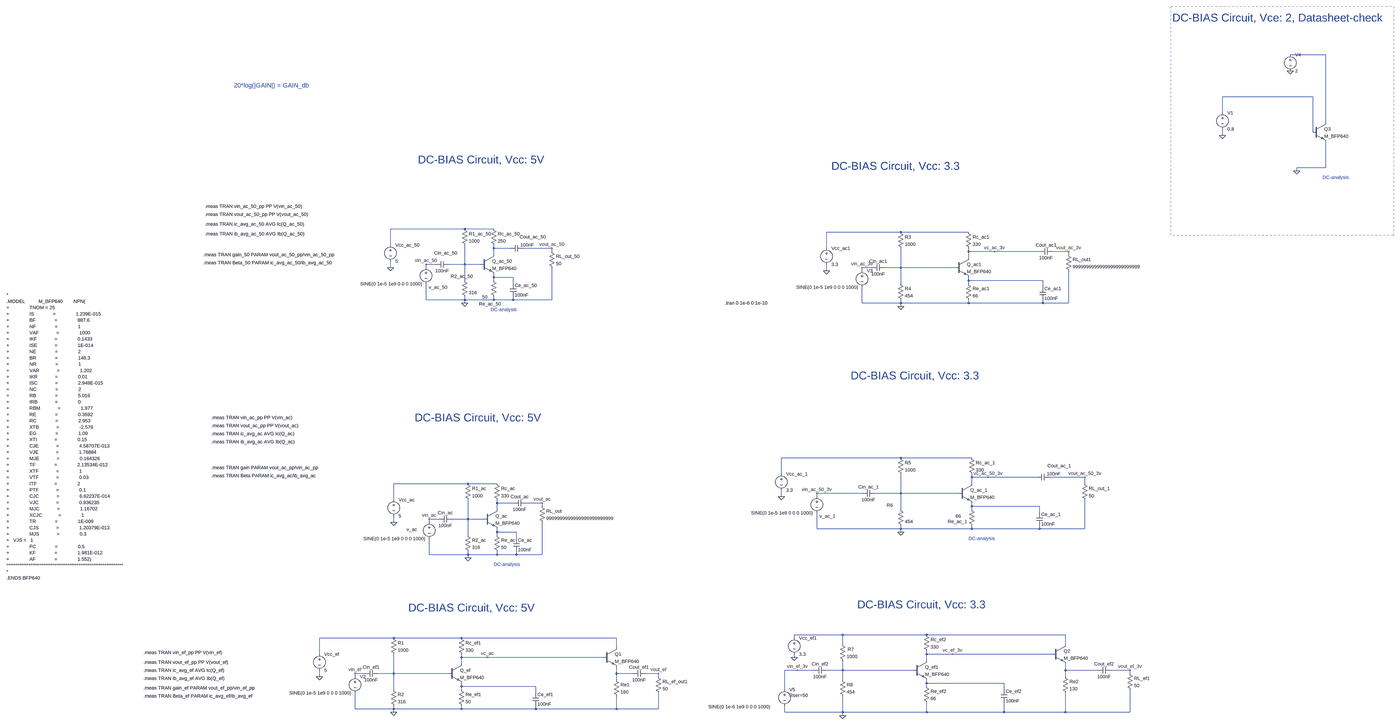
[diagram p0: schematic BP640_AC.asc, whole sheet]
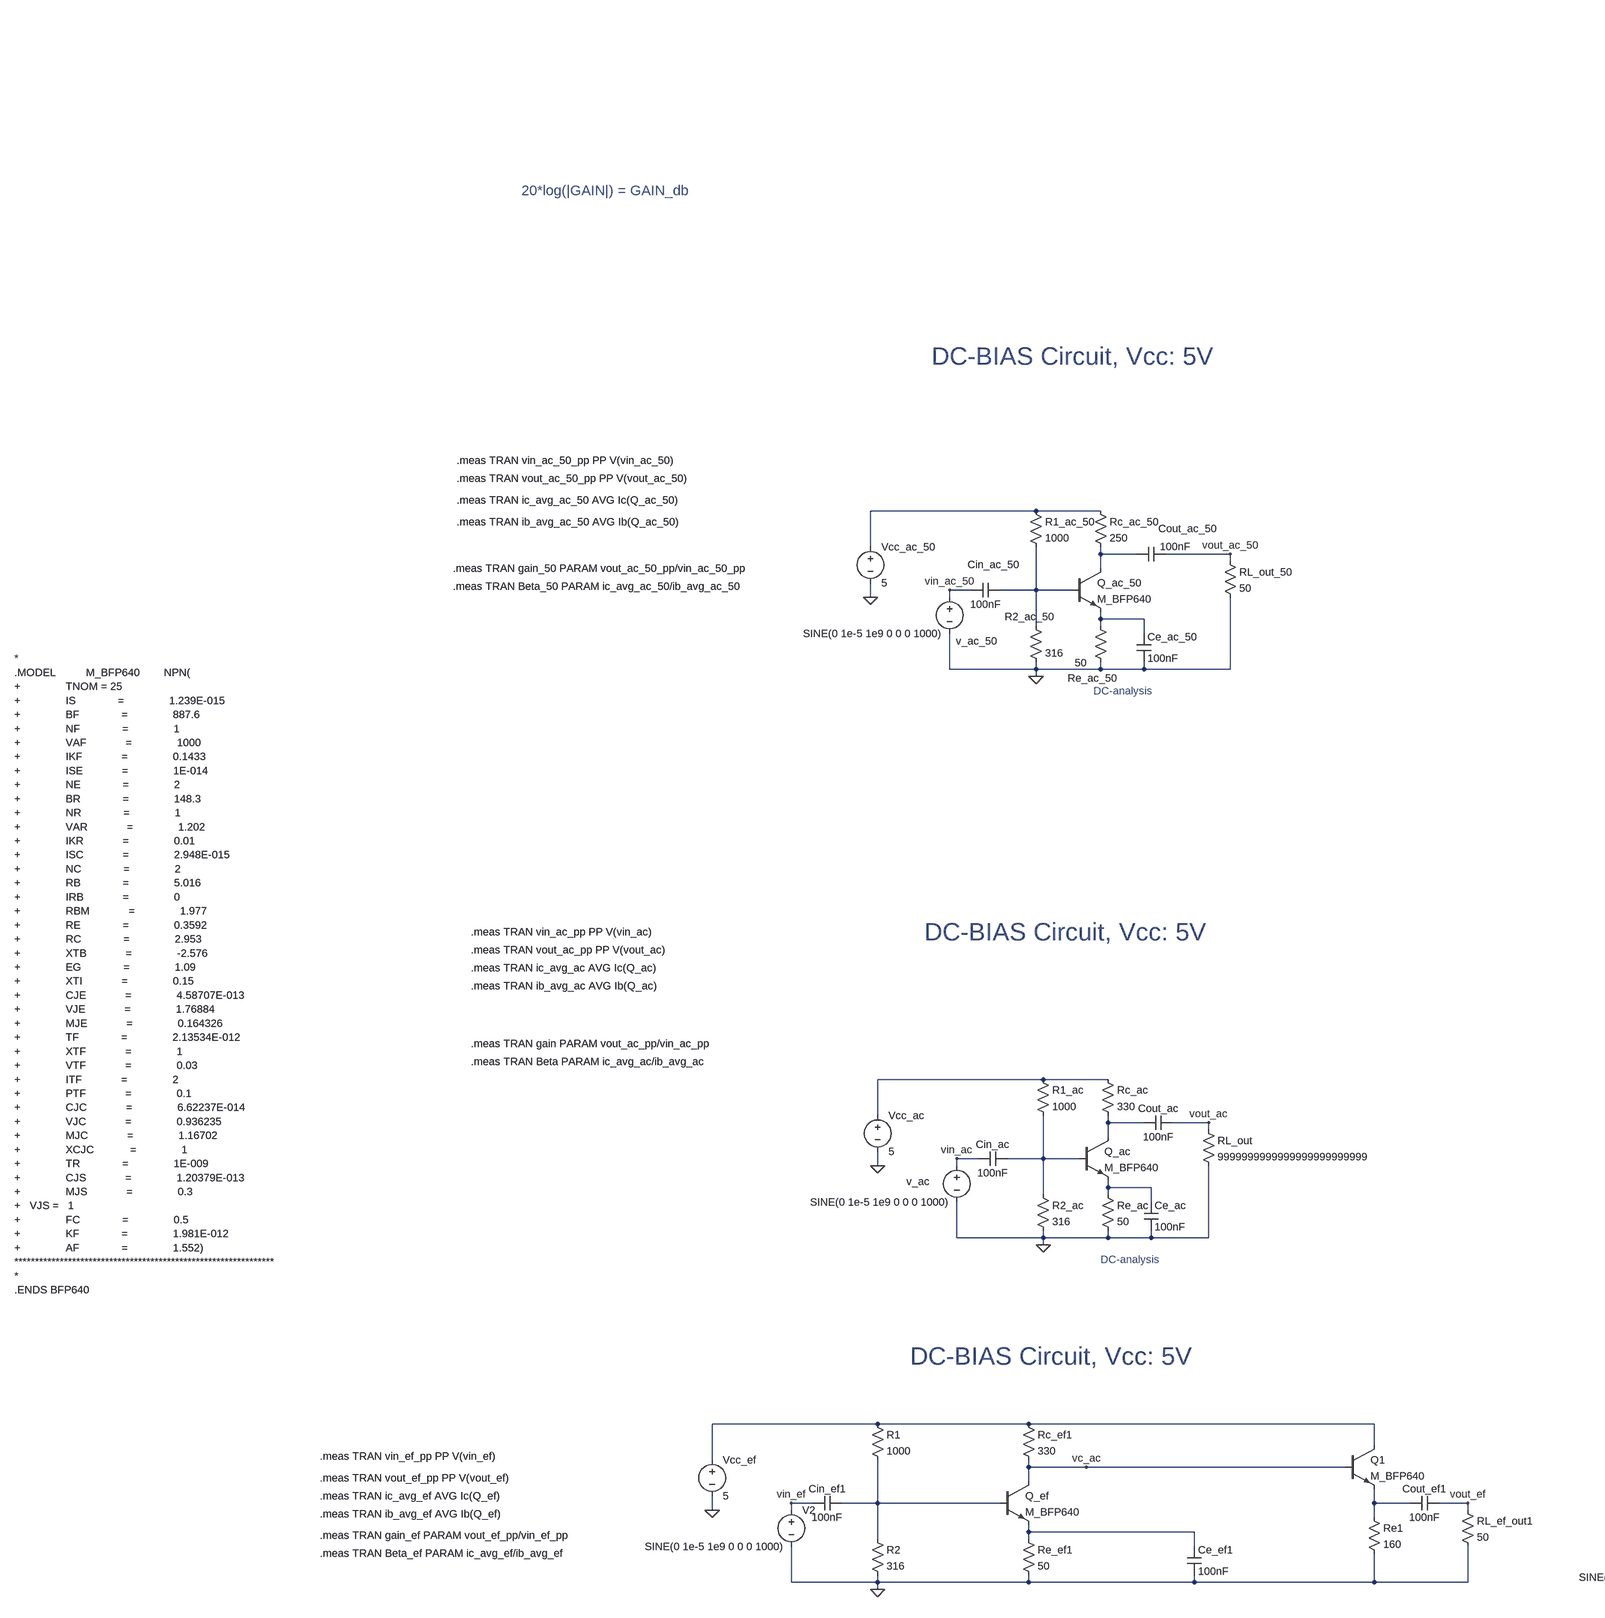
[diagram p1: schematic BP640_AC.asc, part, row 1 of 1, column 1 of 2]
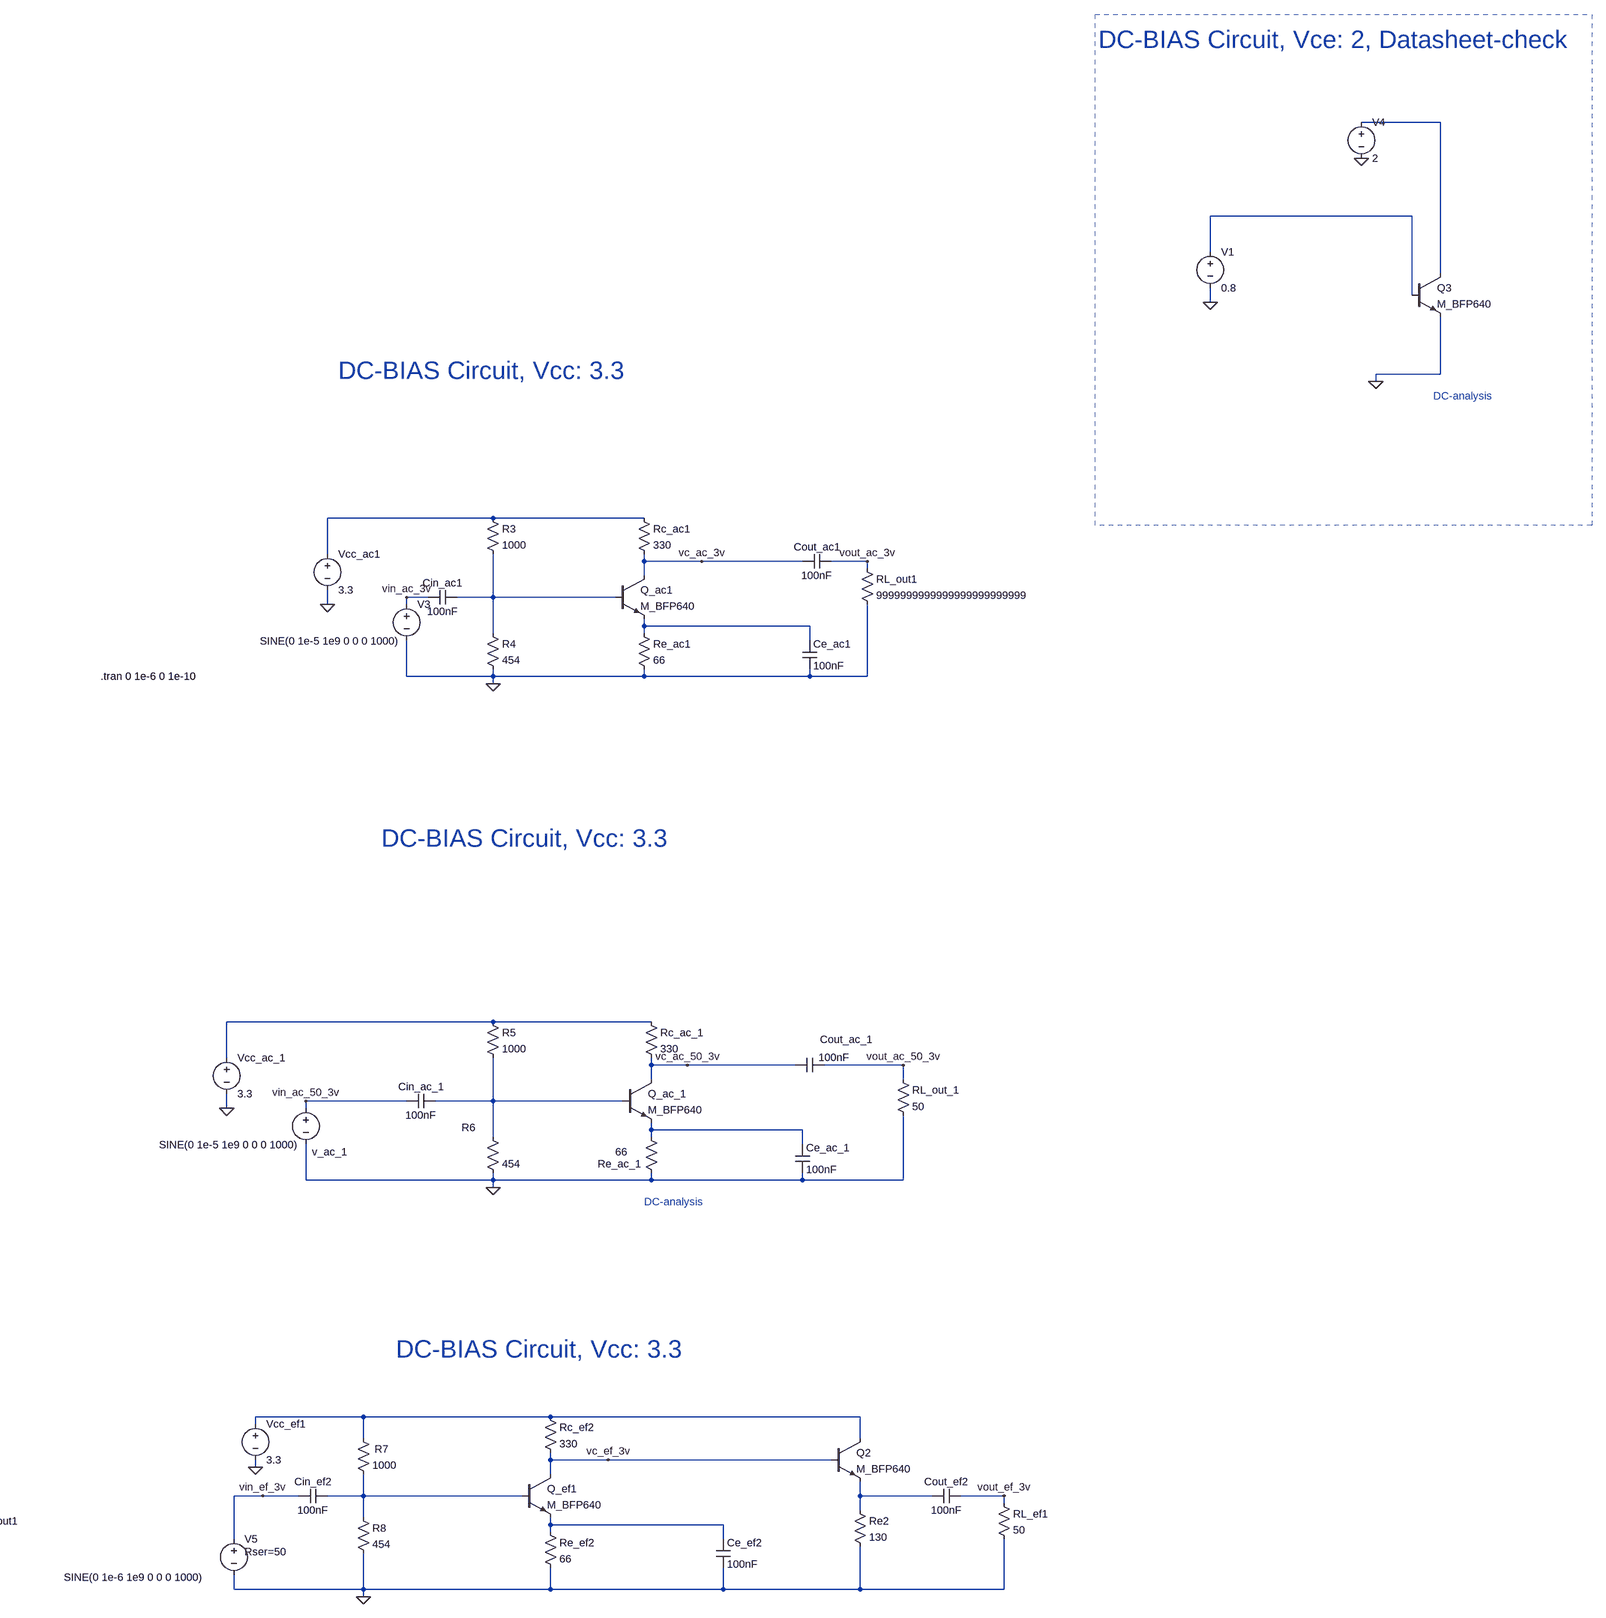
[diagram p2: schematic BP640_AC.asc, part, row 1 of 1, column 2 of 2]
BP640_AC.asc, the LTspice schematic file:
Version 4
SHEET 1 9212 2740
WIRE 8864 -992 8688 -992
WIRE 8800 -784 8352 -784
WIRE 8352 -704 8352 -784
WIRE 8864 -656 8864 -992
WIRE 8800 -608 8800 -784
WIRE 8352 -592 8352 -624
WIRE 8864 -432 8864 -560
WIRE 8864 -432 8720 -432
WIRE 8720 -416 8720 -432
WIRE 2560 -128 2192 -128
WIRE 2704 -128 2560 -128
WIRE 4816 -112 4448 -112
WIRE 5152 -112 4816 -112
WIRE 2192 -48 2192 -128
WIRE 2704 -32 2704 -48
WIRE 2784 -32 2704 -32
WIRE 2992 -32 2848 -32
WIRE 4448 -32 4448 -112
WIRE 2992 -16 2992 -32
WIRE 5152 -16 5152 -32
WIRE 5280 -16 5152 -16
WIRE 5504 -16 5280 -16
WIRE 5648 -16 5568 -16
WIRE 2704 0 2704 -32
WIRE 5648 0 5648 -16
WIRE 5152 16 5152 -16
WIRE 2416 48 2368 48
WIRE 2560 48 2560 -48
WIRE 2560 48 2480 48
WIRE 2640 48 2560 48
WIRE 2192 64 2192 32
WIRE 2368 64 2368 48
WIRE 4672 64 4624 64
WIRE 4816 64 4816 -32
WIRE 4816 64 4736 64
WIRE 5088 64 4816 64
WIRE 4448 80 4448 48
WIRE 4624 80 4624 64
WIRE 2704 112 2704 96
WIRE 2800 112 2704 112
WIRE 2560 128 2560 48
WIRE 2704 128 2704 112
WIRE 5152 128 5152 112
WIRE 5520 128 5152 128
WIRE 2800 144 2800 112
WIRE 4816 144 4816 64
WIRE 5152 144 5152 128
WIRE 5520 160 5520 128
WIRE 2368 224 2368 144
WIRE 2560 224 2560 208
WIRE 2560 224 2368 224
WIRE 2704 224 2704 208
WIRE 2704 224 2560 224
WIRE 2800 224 2800 208
WIRE 2800 224 2704 224
WIRE 2992 224 2992 64
WIRE 2992 224 2800 224
WIRE 2560 240 2560 224
WIRE 4624 240 4624 160
WIRE 4816 240 4816 224
WIRE 4816 240 4624 240
WIRE 5152 240 5152 224
WIRE 5152 240 4816 240
WIRE 5520 240 5520 224
WIRE 5520 240 5152 240
WIRE 5648 240 5648 80
WIRE 5648 240 5520 240
WIRE 4816 256 4816 240
WIRE 4816 1008 4224 1008
WIRE 5168 1008 4816 1008
WIRE 4224 1088 4224 1008
WIRE 5168 1104 5168 1088
WIRE 5248 1104 5168 1104
WIRE 5488 1104 5248 1104
WIRE 5728 1104 5552 1104
WIRE 2576 1136 2208 1136
WIRE 2720 1136 2576 1136
WIRE 5168 1136 5168 1104
WIRE 5728 1136 5728 1104
WIRE 4624 1184 4400 1184
WIRE 4816 1184 4816 1088
WIRE 4816 1184 4688 1184
WIRE 5104 1184 4816 1184
WIRE 4224 1200 4224 1168
WIRE 4400 1200 4400 1184
WIRE 2208 1216 2208 1136
WIRE 2720 1232 2720 1216
WIRE 2800 1232 2720 1232
WIRE 2944 1232 2864 1232
WIRE 2944 1248 2944 1232
WIRE 5168 1248 5168 1232
WIRE 5504 1248 5168 1248
WIRE 2720 1264 2720 1232
WIRE 4816 1264 4816 1184
WIRE 5168 1264 5168 1248
WIRE 5504 1280 5504 1248
WIRE 2432 1312 2384 1312
WIRE 2576 1312 2576 1216
WIRE 2576 1312 2496 1312
WIRE 2656 1312 2576 1312
WIRE 2208 1328 2208 1296
WIRE 2384 1328 2384 1312
WIRE 4400 1360 4400 1280
WIRE 4816 1360 4816 1344
WIRE 4816 1360 4400 1360
WIRE 5168 1360 5168 1344
WIRE 5168 1360 4816 1360
WIRE 5504 1360 5504 1344
WIRE 5504 1360 5168 1360
WIRE 5728 1360 5728 1216
WIRE 5728 1360 5504 1360
WIRE 2720 1376 2720 1360
WIRE 2816 1376 2720 1376
WIRE 4816 1376 4816 1360
WIRE 2576 1392 2576 1312
WIRE 2720 1392 2720 1376
WIRE 2816 1408 2816 1376
WIRE 2384 1488 2384 1408
WIRE 2576 1488 2576 1472
WIRE 2576 1488 2384 1488
WIRE 2720 1488 2720 1472
WIRE 2720 1488 2576 1488
WIRE 2816 1488 2816 1472
WIRE 2816 1488 2720 1488
WIRE 2944 1488 2944 1328
WIRE 2944 1488 2816 1488
WIRE 2576 1504 2576 1488
WIRE 4528 2176 4288 2176
WIRE 4944 2176 4528 2176
WIRE 5632 2176 4944 2176
WIRE 2208 2192 1840 2192
WIRE 2544 2192 2208 2192
WIRE 3312 2192 2544 2192
WIRE 4288 2192 4288 2176
WIRE 4528 2224 4528 2176
WIRE 5632 2224 5632 2176
WIRE 3312 2240 3312 2192
WIRE 1840 2272 1840 2192
WIRE 4944 2272 4944 2256
WIRE 5072 2272 4944 2272
WIRE 5568 2272 5072 2272
WIRE 2544 2288 2544 2272
WIRE 2672 2288 2544 2288
WIRE 3248 2288 2672 2288
WIRE 4288 2288 4288 2272
WIRE 4944 2304 4944 2272
WIRE 2544 2320 2544 2288
WIRE 4304 2352 4240 2352
WIRE 4384 2352 4304 2352
WIRE 4528 2352 4528 2304
WIRE 4528 2352 4448 2352
WIRE 4880 2352 4528 2352
WIRE 5632 2352 5632 2320
WIRE 5792 2352 5632 2352
WIRE 5952 2352 5856 2352
WIRE 2064 2368 2016 2368
WIRE 2208 2368 2208 2272
WIRE 2208 2368 2128 2368
WIRE 2480 2368 2208 2368
WIRE 3312 2368 3312 2336
WIRE 3392 2368 3312 2368
WIRE 3520 2368 3456 2368
WIRE 5952 2368 5952 2352
WIRE 1840 2384 1840 2352
WIRE 2016 2384 2016 2368
WIRE 3520 2384 3520 2368
WIRE 5632 2384 5632 2352
WIRE 3312 2400 3312 2368
WIRE 4528 2400 4528 2352
WIRE 4944 2416 4944 2400
WIRE 5328 2416 4944 2416
WIRE 2544 2432 2544 2416
WIRE 2912 2432 2544 2432
WIRE 4944 2432 4944 2416
WIRE 2208 2448 2208 2368
WIRE 2544 2448 2544 2432
WIRE 4240 2448 4240 2352
WIRE 5328 2448 5328 2416
WIRE 2912 2464 2912 2432
WIRE 2016 2544 2016 2464
WIRE 2208 2544 2208 2528
WIRE 2208 2544 2016 2544
WIRE 2544 2544 2544 2528
WIRE 2544 2544 2208 2544
WIRE 2912 2544 2912 2528
WIRE 2912 2544 2544 2544
WIRE 3312 2544 3312 2480
WIRE 3312 2544 2912 2544
WIRE 3520 2544 3520 2464
WIRE 3520 2544 3312 2544
WIRE 2208 2560 2208 2544
WIRE 4240 2560 4240 2528
WIRE 4528 2560 4528 2480
WIRE 4528 2560 4240 2560
WIRE 4944 2560 4944 2512
WIRE 4944 2560 4528 2560
WIRE 5328 2560 5328 2512
WIRE 5328 2560 4944 2560
WIRE 5632 2560 5632 2464
WIRE 5632 2560 5328 2560
WIRE 5952 2560 5952 2448
WIRE 5952 2560 5632 2560
WIRE 4528 2576 4528 2560
FLAG 2208 1328 0
FLAG 2576 1504 0
FLAG 8352 -592 0
FLAG 8720 -416 0
FLAG 8688 -912 0
FLAG 2192 64 0
FLAG 2560 240 0
FLAG 2384 1312 vin_ac
FLAG 2368 48 vin_ac_50
FLAG 2992 -32 vout_ac_50
FLAG 2944 1232 vout_ac
FLAG 1840 2384 0
FLAG 2208 2560 0
FLAG 2016 2368 vin_ef
FLAG 3520 2368 vout_ef
FLAG 2672 2288 vc_ac
FLAG 4448 80 0
FLAG 4816 256 0
FLAG 4224 1200 0
FLAG 4816 1376 0
FLAG 4400 1184 vin_ac_50_3v
FLAG 5728 1104 vout_ac_50_3v
FLAG 4624 64 vin_ac_3v
FLAG 5648 -16 vout_ac_3v
FLAG 5280 -16 vc_ac_3v
FLAG 5248 1104 vc_ac_50_3v
FLAG 4288 2288 0
FLAG 4528 2576 0
FLAG 4304 2352 vin_ef_3v
FLAG 5952 2352 vout_ef_3v
FLAG 5072 2272 vc_ef_3v
SYMBOL voltage 2208 1200 R0
WINDOW 123 0 0 Left 0
WINDOW 39 0 0 Left 0
SYMATTR InstName Vcc_ac
SYMATTR Value 5
SYMBOL npn 2656 1264 R0
SYMATTR InstName Q_ac
SYMATTR Value M_BFP640
SYMBOL res 2560 1120 R0
SYMATTR InstName R1_ac
SYMATTR Value 1000
SYMBOL res 2560 1376 R0
SYMATTR InstName R2_ac
SYMATTR Value 316
SYMBOL res 2704 1376 R0
SYMATTR InstName Re_ac
SYMATTR Value 50
SYMBOL res 2704 1120 R0
SYMATTR InstName Rc_ac
SYMATTR Value 330
SYMBOL voltage 8352 -720 R0
WINDOW 123 0 0 Left 0
WINDOW 39 0 0 Left 0
SYMATTR InstName V1
SYMATTR Value 0.8
SYMBOL npn 8800 -656 R0
SYMATTR InstName Q3
SYMATTR Value M_BFP640
SYMBOL voltage 8688 -1008 R0
WINDOW 123 0 0 Left 0
WINDOW 39 0 0 Left 0
SYMATTR InstName V4
SYMATTR Value 2
SYMBOL res 2928 1232 R0
SYMATTR InstName RL_out
SYMATTR Value 9999999999999999999999999
SYMBOL cap 2800 1408 R0
SYMATTR InstName Ce_ac
SYMATTR Value 100nF
SYMBOL cap 2864 1216 R90
WINDOW 0 0 32 VBottom 2
WINDOW 3 32 32 VTop 2
SYMATTR InstName Cout_ac
SYMATTR Value 100nF
SYMBOL cap 2496 1296 R90
WINDOW 0 0 32 VBottom 2
WINDOW 3 32 32 VTop 2
SYMATTR InstName Cin_ac
SYMATTR Value 100nF
SYMBOL voltage 2384 1312 R0
WINDOW 3 -326 97 Left 2
WINDOW 123 0 0 Left 0
WINDOW 39 0 0 Left 0
WINDOW 0 -112 51 Left 2
SYMATTR Value SINE(0 1e-5 1e9 0 0 0 1000)
SYMATTR InstName v_ac
SYMBOL voltage 2192 -64 R0
WINDOW 123 0 0 Left 0
WINDOW 39 0 0 Left 0
SYMATTR InstName Vcc_ac_50
SYMATTR Value 5
SYMBOL npn 2640 0 R0
SYMATTR InstName Q_ac_50
SYMATTR Value M_BFP640
SYMBOL res 2544 -144 R0
SYMATTR InstName R1_ac_50
SYMATTR Value 1000
SYMBOL res 2544 112 R0
WINDOW 0 -54 -5 Left 2
SYMATTR InstName R2_ac_50
SYMATTR Value 316
SYMBOL res 2688 112 R0
WINDOW 0 -58 132 Left 2
WINDOW 3 -42 98 Left 2
SYMATTR InstName Re_ac_50
SYMATTR Value 50
SYMBOL res 2688 -144 R0
SYMATTR InstName Rc_ac_50
SYMATTR Value 250
SYMBOL res 2976 -32 R0
SYMATTR InstName RL_out_50
SYMATTR Value 50
SYMBOL cap 2784 144 R0
SYMATTR InstName Ce_ac_50
SYMATTR Value 100nF
SYMBOL cap 2848 -48 R90
WINDOW 0 -25 -49 VBottom 2
WINDOW 3 -16 -22 VTop 2
SYMATTR InstName Cout_ac_50
SYMATTR Value 100nF
SYMBOL cap 2480 32 R90
WINDOW 0 -25 14 VBottom 2
WINDOW 3 32 32 VTop 2
SYMATTR InstName Cin_ac_50
SYMATTR Value 100nF
SYMBOL voltage 2368 48 R0
WINDOW 0 14 113 Left 2
WINDOW 3 -326 97 Left 2
WINDOW 123 0 0 Left 0
WINDOW 39 0 0 Left 0
SYMATTR InstName v_ac_50
SYMATTR Value SINE(0 1e-5 1e9 0 0 0 1000)
SYMBOL voltage 1840 2256 R0
WINDOW 123 0 0 Left 0
WINDOW 39 0 0 Left 0
SYMATTR InstName Vcc_ef
SYMATTR Value 5
SYMBOL npn 2480 2320 R0
SYMATTR InstName Q_ef
SYMATTR Value M_BFP640
SYMBOL res 2192 2176 R0
SYMATTR InstName R1
SYMATTR Value 1000
SYMBOL res 2192 2432 R0
SYMATTR InstName R2
SYMATTR Value 316
SYMBOL res 2528 2432 R0
SYMATTR InstName Re_ef1
SYMATTR Value 50
SYMBOL res 2528 2176 R0
SYMATTR InstName Rc_ef1
SYMATTR Value 330
SYMBOL res 3504 2368 R0
SYMATTR InstName RL_ef_out1
SYMATTR Value 50
SYMBOL cap 2896 2464 R0
SYMATTR InstName Ce_ef1
SYMATTR Value 100nF
SYMBOL cap 3456 2352 R90
WINDOW 0 0 32 VBottom 2
WINDOW 3 32 32 VTop 2
SYMATTR InstName Cout_ef1
SYMATTR Value 100nF
SYMBOL cap 2128 2352 R90
WINDOW 0 0 32 VBottom 2
WINDOW 3 32 32 VTop 2
SYMATTR InstName Cin_ef1
SYMATTR Value 100nF
SYMBOL voltage 2016 2368 R0
WINDOW 3 -326 97 Left 2
WINDOW 123 0 0 Left 0
WINDOW 39 0 0 Left 0
SYMATTR Value SINE(0 1e-5 1e9 0 0 0 1000)
SYMATTR InstName V2
SYMBOL npn 3248 2240 R0
SYMATTR InstName Q1
SYMATTR Value M_BFP640
SYMBOL res 3296 2384 R0
SYMATTR InstName Re1
SYMATTR Value 160
SYMBOL voltage 4448 -48 R0
WINDOW 123 0 0 Left 0
WINDOW 39 0 0 Left 0
SYMATTR InstName Vcc_ac1
SYMATTR Value 3.3
SYMBOL npn 5088 16 R0
SYMATTR InstName Q_ac1
SYMATTR Value M_BFP640
SYMBOL res 4800 -128 R0
SYMATTR InstName R3
SYMATTR Value 1000
SYMBOL res 4800 128 R0
SYMATTR InstName R4
SYMATTR Value 454
SYMBOL res 5136 128 R0
SYMATTR InstName Re_ac1
SYMATTR Value 66
SYMBOL res 5136 -128 R0
SYMATTR InstName Rc_ac1
SYMATTR Value 330
SYMBOL res 5632 -16 R0
SYMATTR InstName RL_out1
SYMATTR Value 9999999999999999999999999
SYMBOL cap 5504 160 R0
SYMATTR InstName Ce_ac1
SYMATTR Value 100nF
SYMBOL cap 5568 -32 R90
WINDOW 0 0 32 VBottom 2
WINDOW 3 32 32 VTop 2
SYMATTR InstName Cout_ac1
SYMATTR Value 100nF
SYMBOL cap 4736 48 R90
WINDOW 0 0 32 VBottom 2
WINDOW 3 32 32 VTop 2
SYMATTR InstName Cin_ac1
SYMATTR Value 100nF
SYMBOL voltage 4624 64 R0
WINDOW 3 -326 97 Left 2
WINDOW 123 0 0 Left 0
WINDOW 39 0 0 Left 0
SYMATTR Value SINE(0 1e-5 1e9 0 0 0 1000)
SYMATTR InstName V3
SYMBOL voltage 4224 1072 R0
WINDOW 123 0 0 Left 0
WINDOW 39 0 0 Left 0
SYMATTR InstName Vcc_ac_1
SYMATTR Value 3.3
SYMBOL npn 5104 1136 R0
SYMATTR InstName Q_ac_1
SYMATTR Value M_BFP640
SYMBOL res 4800 992 R0
SYMATTR InstName R5
SYMATTR Value 1000
SYMBOL res 4800 1248 R0
WINDOW 0 -54 -5 Left 2
SYMATTR InstName R6
SYMATTR Value 454
SYMBOL res 5152 1248 R0
WINDOW 0 -103 76 Left 2
WINDOW 3 -64 49 Left 2
SYMATTR InstName Re_ac_1
SYMATTR Value 66
SYMBOL res 5152 992 R0
SYMATTR InstName Rc_ac_1
SYMATTR Value 330
SYMBOL res 5712 1120 R0
SYMATTR InstName RL_out_1
SYMATTR Value 50
SYMBOL cap 5488 1280 R0
SYMATTR InstName Ce_ac_1
SYMATTR Value 100nF
SYMBOL cap 5552 1088 R90
WINDOW 0 -25 -49 VBottom 2
WINDOW 3 -16 -22 VTop 2
SYMATTR InstName Cout_ac_1
SYMATTR Value 100nF
SYMBOL cap 4688 1168 R90
WINDOW 0 0 32 VBottom 2
WINDOW 3 32 32 VTop 2
SYMATTR InstName Cin_ac_1
SYMATTR Value 100nF
SYMBOL voltage 4400 1184 R0
WINDOW 0 14 113 Left 2
WINDOW 3 -326 97 Left 2
WINDOW 123 0 0 Left 0
WINDOW 39 0 0 Left 0
SYMATTR InstName v_ac_1
SYMATTR Value SINE(0 1e-5 1e9 0 0 0 1000)
SYMBOL voltage 4288 2176 R0
WINDOW 123 0 0 Left 0
WINDOW 39 0 0 Left 0
SYMATTR InstName Vcc_ef1
SYMATTR Value 3.3
SYMBOL npn 4880 2304 R0
SYMATTR InstName Q_ef1
SYMATTR Value M_BFP640
SYMBOL res 4512 2208 R0
WINDOW 0 41 40 Left 2
SYMATTR InstName R7
SYMATTR Value 1000
SYMBOL res 4512 2384 R0
SYMATTR InstName R8
SYMATTR Value 454
SYMBOL res 4928 2416 R0
SYMATTR InstName Re_ef2
SYMATTR Value 66
SYMBOL res 4928 2160 R0
SYMATTR InstName Rc_ef2
SYMATTR Value 330
SYMBOL res 5936 2352 R0
SYMATTR InstName RL_ef1
SYMATTR Value 50
SYMBOL cap 5312 2448 R0
SYMATTR InstName Ce_ef2
SYMATTR Value 100nF
SYMBOL cap 5856 2336 R90
WINDOW 0 0 32 VBottom 2
WINDOW 3 32 32 VTop 2
SYMATTR InstName Cout_ef2
SYMATTR Value 100nF
SYMBOL cap 4448 2336 R90
WINDOW 0 0 32 VBottom 2
WINDOW 3 32 32 VTop 2
SYMATTR InstName Cin_ef2
SYMATTR Value 100nF
SYMBOL voltage 4240 2432 R0
WINDOW 3 -378 101 Left 2
WINDOW 123 0 0 Left 0
WINDOW 39 24 44 Left 2
SYMATTR Value SINE(0 1e-6 1e9 0 0 0 1000)
SYMATTR SpiceLine Rser=50
SYMATTR InstName V5
SYMBOL npn 5568 2224 R0
SYMATTR InstName Q2
SYMATTR Value M_BFP640
SYMBOL res 5616 2368 R0
SYMATTR InstName Re2
SYMATTR Value 130
TEXT 2704 1536 Left 2 ;DC-analysis
TEXT 3944 240 Left 2 !.tran 0 1e-6 0 1e-10
TEXT 2312 808 Left 5 ;DC-BIAS Circuit, Vcc: 5V
TEXT 8848 -384 Left 2 ;DC-analysis
TEXT 8104 -1176 Left 5 ;DC-BIAS Circuit, Vce: 2, Datasheet-check
TEXT 2688 272 Left 2 ;DC-analysis
TEXT 2328 -472 Left 5 ;DC-BIAS Circuit, Vcc: 5V
TEXT 1416 -840 Left 3 ;20*log(|GAIN|) = GAIN_db
TEXT 1272 -240 Left 2 !.meas TRAN vin_ac_50_pp PP V(vin_ac_50)
TEXT 1272 -200 Left 2 !.meas TRAN vout_ac_50_pp PP V(vout_ac_50)
TEXT 1304 808 Left 2 !.meas TRAN vin_ac_pp PP V(vin_ac)
TEXT 1304 848 Left 2 !.meas TRAN vout_ac_pp PP V(vout_ac)
TEXT 1272 -152 Left 2 !.meas TRAN ic_avg_ac_50 AVG Ic(Q_ac_50)
TEXT 1272 -104 Left 2 !.meas TRAN ib_avg_ac_50 AVG Ib(Q_ac_50)
TEXT 1304 888 Left 2 !.meas TRAN ic_avg_ac AVG Ic(Q_ac)
TEXT 1304 928 Left 2 !.meas TRAN ib_avg_ac AVG Ib(Q_ac)
TEXT 1264 0 Left 2 !.meas TRAN gain_50 PARAM vout_ac_50_pp/vin_ac_50_pp
TEXT 1264 40 Left 2 !.meas TRAN Beta_50 PARAM ic_avg_ac_50/ib_avg_ac_50
TEXT 1304 1056 Left 2 !.meas TRAN gain PARAM vout_ac_pp/vin_ac_pp
TEXT 1304 1096 Left 2 !.meas TRAN Beta PARAM ic_avg_ac/ib_avg_ac
TEXT 2280 1920 Left 5 ;DC-BIAS Circuit, Vcc: 5V
TEXT 968 2264 Left 2 !.meas TRAN vin_ef_pp PP V(vin_ef)
TEXT 968 2312 Left 2 !.meas TRAN vout_ef_pp PP V(vout_ef)
TEXT 968 2352 Left 2 !.meas TRAN ic_avg_ef AVG Ic(Q_ef)
TEXT 968 2392 Left 2 !.meas TRAN ib_avg_ef AVG Ib(Q_ef)
TEXT 968 2440 Left 2 !.meas TRAN gain_ef PARAM vout_ef_pp/vin_ef_pp
TEXT 968 2480 Left 2 !.meas TRAN Beta_ef PARAM ic_avg_ef/ib_avg_ef
TEXT 4472 -440 Left 5 ;DC-BIAS Circuit, Vcc: 3.3
TEXT 5152 1408 Left 2 ;DC-analysis
TEXT 4568 600 Left 5 ;DC-BIAS Circuit, Vcc: 3.3
TEXT 4600 1904 Left 5 ;DC-BIAS Circuit, Vcc: 3.3
TEXT -168 200 Left 2 !*\n.MODEL          M_BFP640        NPN(\n+               TNOM = 25\n+               IS              =               1.239E-015\n+               BF              =               887.6\n+               NF              =               1\n+               VAF             =               1000\n+               IKF             =               0.1433\n+               ISE             =               1E-014\n+               NE              =               2\n+               BR              =               148.3\n+               NR              =               1\n+               VAR             =               1.202\n+               IKR             =               0.01\n+               ISC             =               2.948E-015\n+               NC              =               2\n+               RB              =               5.016\n+               IRB             =               0\n+               RBM             =               1.977\n+               RE              =               0.3592\n+               RC              =               2.953\n+               XTB             =               -2.576\n+               EG              =               1.09\n+               XTI             =               0.15\n+               CJE             =               4.58707E-013\n+               VJE             =               1.76884\n+               MJE             =               0.164326\n+               TF              =               2.13534E-012\n+               XTF             =               1\n+               VTF             =               0.03\n+               ITF             =               2\n+               PTF             =               0.1\n+               CJC             =               6.62237E-014\n+               VJC             =               0.936235\n+               MJC             =               1.16702\n+               XCJC            =               1\n+               TR              =               1E-009\n+               CJS             =               1.20379E-013\n+               MJS             =               0.3\n+   VJS =   1\n+               FC              =               0.5\n+               KF              =               1.981E-012\n+               AF              =               1.552)\n***************************************************************\n*\n.ENDS BFP640
RECTANGLE Normal 9200 -96 8096 -1232 2

The netlist it stands for:
* BP640_AC.asc
Vcc_ac N011 0 5
Q_ac N013 N015 N016 0 M_BFP640
R1_ac N011 N015 1000
R2_ac N015 0 316
Re_ac N016 0 50
Rc_ac N011 N013 330
V1 N002 0 0.8
Q3 N001 N002 0 0 M_BFP640
V4 N001 0 2
RL_out vout_ac 0 9999999999999999999999999
Ce_ac N016 0 100nF
Cout_ac vout_ac N013 100nF
Cin_ac N015 vin_ac 100nF
v_ac vin_ac 0 SINE(0 1e-5 1e9 0 0 0 1000)
Vcc_ac_50 N003 0 5
Q_ac_50 N005 N006 N008 0 M_BFP640
R1_ac_50 N003 N006 1000
R2_ac_50 N006 0 316
Re_ac_50 N008 0 50
Rc_ac_50 N003 N005 250
RL_out_50 vout_ac_50 0 50
Ce_ac_50 N008 0 100nF
Cout_ac_50 vout_ac_50 N005 100nF
Cin_ac_50 N006 vin_ac_50 100nF
v_ac_50 vin_ac_50 0 SINE(0 1e-5 1e9 0 0 0 1000)
Vcc_ef N018 0 5
Q_ef vc_ac N021 N024 0 M_BFP640
R1 N018 N021 1000
R2 N021 0 316
Re_ef1 N024 0 50
Rc_ef1 N018 vc_ac 330
RL_ef_out1 vout_ef 0 50
Ce_ef1 N024 0 100nF
Cout_ef1 vout_ef N022 100nF
Cin_ef1 N021 vin_ef 100nF
V2 vin_ef 0 SINE(0 1e-5 1e9 0 0 0 1000)
Q1 N018 vc_ac N022 0 M_BFP640
Re1 N022 0 160
Vcc_ac1 N004 0 3.3
Q_ac1 vc_ac_3v N007 N009 0 M_BFP640
R3 N004 N007 1000
R4 N007 0 454
Re_ac1 N009 0 66
Rc_ac1 N004 vc_ac_3v 330
RL_out1 vout_ac_3v 0 9999999999999999999999999
Ce_ac1 N009 0 100nF
Cout_ac1 vout_ac_3v vc_ac_3v 100nF
Cin_ac1 N007 vin_ac_3v 100nF
V3 vin_ac_3v 0 SINE(0 1e-5 1e9 0 0 0 1000)
Vcc_ac_1 N010 0 3.3
Q_ac_1 vc_ac_50_3v N012 N014 0 M_BFP640
R5 N010 N012 1000
R6 N012 0 454
Re_ac_1 N014 0 66
Rc_ac_1 N010 vc_ac_50_3v 330
RL_out_1 vout_ac_50_3v 0 50
Ce_ac_1 N014 0 100nF
Cout_ac_1 vout_ac_50_3v vc_ac_50_3v 100nF
Cin_ac_1 N012 vin_ac_50_3v 100nF
v_ac_1 vin_ac_50_3v 0 SINE(0 1e-5 1e9 0 0 0 1000)
Vcc_ef1 N017 0 3.3
Q_ef1 vc_ef_3v N019 N023 0 M_BFP640
R7 N017 N019 1000
R8 N019 0 454
Re_ef2 N023 0 66
Rc_ef2 N017 vc_ef_3v 330
RL_ef1 vout_ef_3v 0 50
Ce_ef2 N023 0 100nF
Cout_ef2 vout_ef_3v N020 100nF
Cin_ef2 N019 vin_ef_3v 100nF
V5 vin_ef_3v 0 SINE(0 1e-6 1e9 0 0 0 1000) Rser=50
Q2 N017 vc_ef_3v N020 0 M_BFP640
Re2 N020 0 130
.model NPN NPN
.model PNP PNP
.lib standard.bjt
* DC-analysis
.tran 0 1e-6 0 1e-10
* DC-BIAS Circuit, Vcc: 5V
* DC-analysis
* DC-BIAS Circuit, Vce: 2, Datasheet-check
* DC-analysis
* DC-BIAS Circuit, Vcc: 5V
* 20*log(|GAIN|) = GAIN_db
.meas TRAN vin_ac_50_pp PP V(vin_ac_50)
.meas TRAN vout_ac_50_pp PP V(vout_ac_50)
.meas TRAN vin_ac_pp PP V(vin_ac)
.meas TRAN vout_ac_pp PP V(vout_ac)
.meas TRAN ic_avg_ac_50 AVG Ic(Q_ac_50)
.meas TRAN ib_avg_ac_50 AVG Ib(Q_ac_50)
.meas TRAN ic_avg_ac AVG Ic(Q_ac)
.meas TRAN ib_avg_ac AVG Ib(Q_ac)
.meas TRAN gain_50 PARAM vout_ac_50_pp/vin_ac_50_pp
.meas TRAN Beta_50 PARAM ic_avg_ac_50/ib_avg_ac_50
.meas TRAN gain PARAM vout_ac_pp/vin_ac_pp
.meas TRAN Beta PARAM ic_avg_ac/ib_avg_ac
* DC-BIAS Circuit, Vcc: 5V
.meas TRAN vin_ef_pp PP V(vin_ef)
.meas TRAN vout_ef_pp PP V(vout_ef)
.meas TRAN ic_avg_ef AVG Ic(Q_ef)
.meas TRAN ib_avg_ef AVG Ib(Q_ef)
.meas TRAN gain_ef PARAM vout_ef_pp/vin_ef_pp
.meas TRAN Beta_ef PARAM ic_avg_ef/ib_avg_ef
* DC-BIAS Circuit, Vcc: 3.3
* DC-analysis
* DC-BIAS Circuit, Vcc: 3.3
* DC-BIAS Circuit, Vcc: 3.3
*
.MODEL          M_BFP640        NPN(
+               TNOM = 25
+               IS              =               1.239E-015
+               BF              =               887.6
+               NF              =               1
+               VAF             =               1000
+               IKF             =               0.1433
+               ISE             =               1E-014
+               NE              =               2
+               BR              =               148.3
+               NR              =               1
+               VAR             =               1.202
+               IKR             =               0.01
+               ISC             =               2.948E-015
+               NC              =               2
+               RB              =               5.016
+               IRB             =               0
+               RBM             =               1.977
+               RE              =               0.3592
+               RC              =               2.953
+               XTB             =               -2.576
+               EG              =               1.09
+               XTI             =               0.15
+               CJE             =               4.58707E-013
+               VJE             =               1.76884
+               MJE             =               0.164326
+               TF              =               2.13534E-012
+               XTF             =               1
+               VTF             =               0.03
+               ITF             =               2
+               PTF             =               0.1
+               CJC             =               6.62237E-014
+               VJC             =               0.936235
+               MJC             =               1.16702
+               XCJC            =               1
+               TR              =               1E-009
+               CJS             =               1.20379E-013
+               MJS             =               0.3
+   VJS =   1
+               FC              =               0.5
+               KF              =               1.981E-012
+               AF              =               1.552)
***************************************************************
*
.ENDS BFP640
.backanno
.end